# EAGLE board servo-ctrl (EAGLE 9.3.0), part 1 of 2
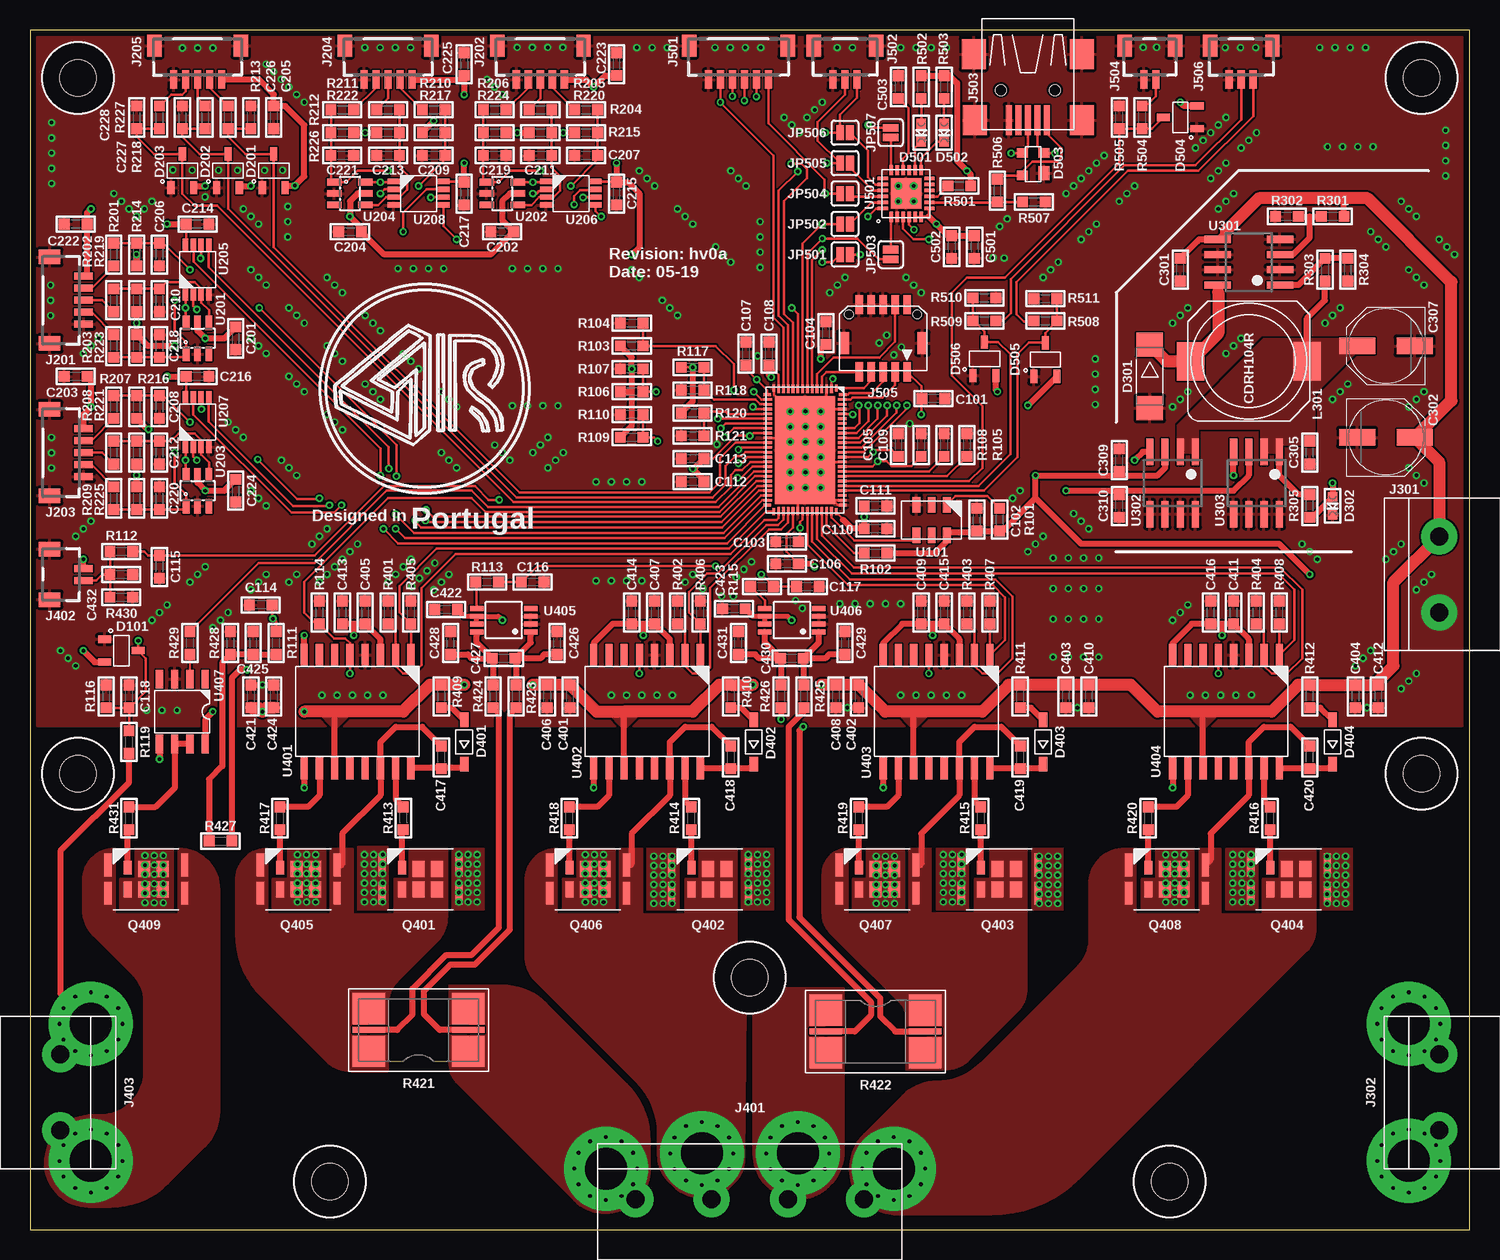
[diagram p5: board, top side]
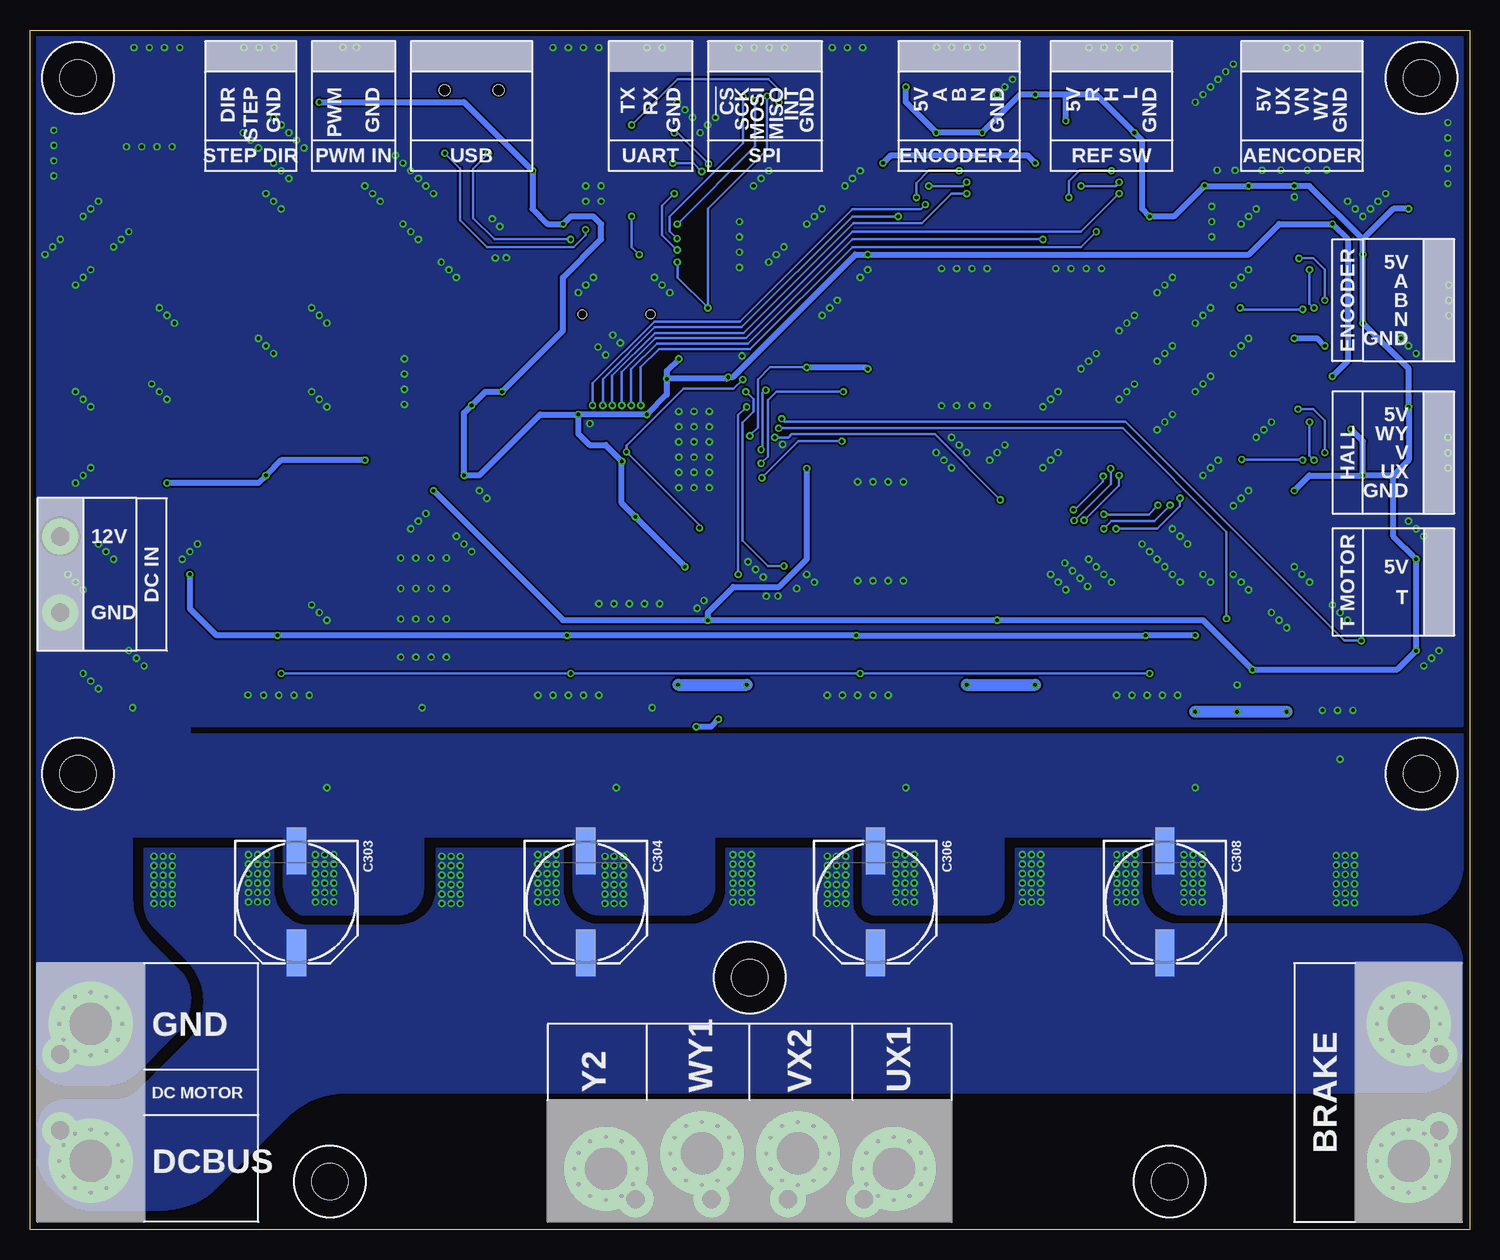
[diagram p6: board, bottom side, seen from below]

Size 120 x 100 mm. Coordinates in mm from the lower left corner, seen from the top.
Outline: 0,0 120,0 120,100 0,100 0,0
Copper layers (1*16): Top 0.035mm / dielectric 1.5mm / Bottom 0.035mm
Design rules "mask_vias *": minimum track width 5mil, minimum drill 0.3mm, track to track 6mil, track to pad 6mil, pad to pad 6mil, via to via 6mil, smd to smd 6mil, copper to edge 0.2mm, drill to drill 5mil, minimum pad ring 3mil, minimum via ring 3mil, stop-mask expansion 4mil, vias tented up to drill 0.8mm, thermal gap 10mil
Holes 3 mm at 4,38 25,4 95,4 116,38 4,96 116,96 60,21
tRestrict: area 57,18 to 63,24; area 1,93 to 7,99; area 113,93 to 119,99
bRestrict: area 113,35 to 119,41; area 57,18 to 63,24; area 1,35 to 7,41; area 1,93 to 7,99; area 113,93 to 119,99

## Footprints (pad centres in the part's own frame; a part is rotated, then mirrored left to right if it is on the bottom)
0603_WAVE = smd 0.9 x 0.9: P$1 -0.95,0; P$2 0.95,0
PANASONIC_D = smd 3 x 1.4: + 2.4,0; - -2.4,0
PANASONIC_G = smd 3.9 x 1.6: + 4.25,0; - -4.25,0
SOT-23-3 = smd 0.6 x 1.1: P$1 -0.95,-1.4; P$2 0.95,-1.4; P$3 0,1.4
DO214AA = smd 2 x 2.2: A 2.65,0; C -2.65,0
CHIPLED_0603 = smd 0.8 x 0.8: A 0,-0.75; C 0,0.75
SOD-123 = smd 1.2 x 0.7: A 1.85,0; C -1.85,0
SOT143 = smd 1.2 x 0.9: 1 -0.711,-0.889 | smd 0.8 x 0.9: 2 0.989,-0.889; 3 0.989,0.911; 4 -0.911,0.911
SM05B-SSR-H-TB = smd 0.6 x 1.55: 1 -2,1.925; 2 -1,1.925; 3 0,1.925; 4 1,1.925; 5 2,1.925 | smd 1.2 x 1.8: FIT@1 -3.6,-0.9; FIT@2 3.6,-0.9
2P-6.35P = drill 1.5 pad 3: 1 -3.175,0; 2 3.175,0
4P-6.35P = drill 1.5 pad 3: 1 -9.525,0; 2 -3.175,0; 3 3.175,0; 4 9.525,0
SM02B-SSR-H-TB = smd 0.6 x 1.55: 1 -0.5,1.925; 2 0.5,1.925 | smd 1.2 x 1.8: FIT@1 -2.1,-0.9; FIT@2 2.1,-0.9
SM06B-SSR-H-TB = smd 0.6 x 1.55: 1 -2.5,1.925; 2 -1.5,1.925; 3 -0.5,1.925; 4 0.5,1.925; 5 1.5,1.925; 6 2.5,1.925 | smd 1.2 x 1.8: FIT@1 -4.1,-0.9; FIT@2 4.1,-0.9
SM03B-SSR-H-TB = smd 0.6 x 1.55: 1 -1,1.925; 2 0,1.925; 3 1,1.925 | smd 1.2 x 1.8: FIT@1 -2.6,-0.9; FIT@2 2.6,-0.9
USB-M-S1 = smd 2.5 x 0.5: D+ 2.75,0; D- 2.75,0.8; GND 2.75,-1.6; ID 2.75,-0.8; VBUS 2.75,1.6 | smd 2.5 x 2: GND@1 -2.75,-4.5; GND@2 -2.75,4.5; GND@3 2.75,-4.4; GND@4 2.75,4.5 | hole 0.9: 0.25,2.25; 0.25,-2.25
F20F-10DP-1V = smd 0.6 x 1.6: 1 -2,2.8; 2 -2,-2.8; 3 -1,2.8; 4 -1,-2.8; 5 0,2.8; 6 0,-2.8; 7 1,2.8; 8 1,-2.8; 9 2,2.8; 10 2,-2.8 | smd 0.85 x 1.8: TAB1 -3.275,0.4; TAB2 3.275,0.4 | hole 0.7: -2.85,-2.005; 2.85,-2.005
SMT-JUMPER_2_NC_PASTE_SILK = smd 0.635 x 1.27: 1 -0.406,0; 2 0.406,0
SMT-JUMPER_2_NO_SILK = smd 0.635 x 1.27: 1 -0.406,0; 2 0.406,0
CDRH104R = smd 3.2 x 2.3: 1 0,-4.85; 2 0,4.85
TH-HP = drill 0.3: H1 2.625,0; H2 2.273,1.312; H3 1.312,2.273; H4 0,2.625; H5 -1.312,2.273; H6 -2.273,1.312; H7 -2.625,0; H8 -2.273,-1.312; H9 -1.312,-2.273; H10 0,-2.625; H11 1.312,-2.273; H12 2.273,-1.312 | drill 3.5 pad 7: PAD 0,0
DIRECTFET-ME = smd 0.6 x 1.9: D1 -3.025,1.175; D2 -3.025,-1.175; D3 3.375,-1.175; D4 3.375,1.175 | smd 0.65 x 1.15: G -1.375,0.95 | smd 0.65 x 1.35: S1 -1.375,-0.85 | smd 1 x 1.35: S2 0,-0.85; S3 1.55,-0.85; S4 1.55,0.85; S5 0,0.85
3920 = smd 2.7 x 2.592: 1 -4.15,1.778; 2 -4.15,-1.778; 3 4.15,-1.778; 4 4.15,1.778 | smd 2.7 x 0.508: SENSE+ -4.15,0; SENSE- 4.15,0
CDFN_5X3.2 = smd 1.3 x 0.64: 1 -1.277,1.27; 2 -1.277,0; 3 -1.277,-1.27; 4 1.277,-1.27; 5 1.277,0; 6 1.277,1.27
QFN76 = smd 0.6 x 0.225: 1 -5.15,2.6; 14 -5.15,-2.6; 39 5.15,-2.6; 52 5.15,2.6 | smd 0.7 x 0.225: 2 -5.1,2.2; 3 -5.1,1.8; 4 -5.1,1.4; 5 -5.1,1; 6 -5.1,0.6; 7 -5.1,0.2; 8 -5.1,-0.2; 9 -5.1,-0.6; 10 -5.1,-1; 11 -5.1,-1.4; 12 -5.1,-1.8; 13 -5.1,-2.2; 40 5.1,-2.2; 41 5.1,-1.8; 42 5.1,-1.4; 43 5.1,-1; 44 5.1,-0.6; 45 5.1,-0.2; 46 5.1,0.2; 47 5.1,0.6; 48 5.1,1; 49 5.1,1.4; 50 5.1,1.8; 51 5.1,2.2 | smd 0.225 x 0.6: 15 -4.6,-3.15; 38 4.6,-3.15; 53 4.6,3.15; 76 -4.6,3.15 | smd 0.225 x 0.7: 16 -4.2,-3.1; 17 -3.8,-3.1; 18 -3.4,-3.1; 19 -3,-3.1; 20 -2.6,-3.1; 21 -2.2,-3.1; 22 -1.8,-3.1; 23 -1.4,-3.1; 24 -1,-3.1; 25 -0.6,-3.1; 26 -0.2,-3.1; 27 0.2,-3.1; 28 0.6,-3.1; 29 1,-3.1; 30 1.4,-3.1; 31 1.8,-3.1; 32 2.2,-3.1; 33 2.6,-3.1; 34 3,-3.1; 35 3.4,-3.1; 36 3.8,-3.1; 37 4.2,-3.1; 54 4.2,3.1; 55 3.8,3.1; 56 3.4,3.1; 57 3,3.1; 58 2.6,3.1; 59 2.2,3.1; 60 1.8,3.1; 61 1.4,3.1; 62 1,3.1; 63 0.6,3.1; 64 0.2,3.1; 65 -0.2,3.1; 66 -0.6,3.1; 67 -1,3.1; 68 -1.4,3.1; 69 -1.8,3.1; 70 -2.2,3.1; 71 -2.6,3.1; 72 -3,3.1; 73 -3.4,3.1; 74 -3.8,3.1; 75 -4.2,3.1 | smd 9 x 5: PAD 0,0
SOT23-6 = smd 0.55 x 1.2: 1 -0.95,-1.3; 2 0,-1.3; 3 0.95,-1.3; 4 0.95,1.3; 5 0,1.3; 6 -0.95,1.3
TSSOP-8 = smd 0.45 x 1: 1 -1.005,-2.081; 2 -0.355,-2.081; 3 0.295,-2.081; 4 0.945,-2.081; 5 0.945,2.081; 6 0.295,2.081; 7 -0.355,2.081; 8 -1.005,2.081
SOIC8 = smd 0.6 x 2.2: 1 -1.905,-2.6; 2 -0.635,-2.6; 3 0.635,-2.6; 4 1.905,-2.6; 5 1.905,2.6; 6 0.635,2.6; 7 -0.635,2.6; 8 -1.905,2.6
SOIC-16-WB = smd 0.6 x 1.9: 1 -4.445,-4.7; 2 -3.175,-4.7; 3 -1.905,-4.7; 4 -0.635,-4.7; 5 0.635,-4.7; 6 1.905,-4.7; 7 3.175,-4.7; 8 4.445,-4.7; 9 4.445,4.7; 10 3.175,4.7; 11 1.905,4.7; 12 0.635,4.7; 13 -0.635,4.7; 14 -1.905,4.7; 15 -3.175,4.7; 16 -4.445,4.7
MSOP-8 = smd 0.4 x 1.1: 1 -0.975,-2.25; 2 -0.325,-2.25; 3 0.325,-2.25; 4 0.975,-2.25; 5 0.975,2.25; 6 0.325,2.25; 7 -0.325,2.25; 8 -0.975,2.25
SOIC_8 = smd 0.6 x 1.55: 1 -1.905,-2.7; 2 -0.635,-2.7; 3 0.635,-2.7; 4 1.905,-2.7; 5 1.905,2.7; 6 0.635,2.7; 7 -0.635,2.7; 8 -1.905,2.7
QFN24 = smd 0.3 x 0.85: 1 -1.25,-1.95; 2 -0.75,-1.95; 3 -0.25,-1.95; 4 0.25,-1.95; 5 0.75,-1.95; 6 1.25,-1.95; 13 1.25,1.95; 14 0.75,1.95; 15 0.25,1.95; 16 -0.25,1.95; 17 -0.75,1.95; 18 -1.25,1.95 | smd 0.85 x 0.3: 7 1.95,-1.25; 8 1.95,-0.75; 9 1.95,-0.25; 10 1.95,0.25; 11 1.95,0.75; 12 1.95,1.25; 19 -1.95,1.25; 20 -1.95,0.75; 21 -1.95,0.25; 22 -1.95,-0.25; 23 -1.95,-0.75; 24 -1.95,-1.25 | smd 2.55 x 2.55: PAD 0,0

## Placement (x,y rotation side)
C101  100n  [0603_WAVE]  75.31,69.28 0 top
C102  100n  [0603_WAVE]  78.93,59.18 90 top
C103  100n  [0603_WAVE]  63.12,57.34 180 top
C104  100n  [0603_WAVE]  66.36,74.74 90 top
C105  100n  [0603_WAVE]  72.39,65.41 90 top
C106  100n  [0603_WAVE]  63.12,55.5 180 top
C107  100n  [0603_WAVE]  59.69,73.03 90 top
C108  100n  [0603_WAVE]  61.59,73.03 90 top
C109  100n  [0603_WAVE]  74.3,65.41 90 top
C110  100n  [0603_WAVE]  70.48,58.42 0 top
C111  4u7  [0603_WAVE]  70.48,60.33 0 top
C112  100n  [0603_WAVE]  55.24,62.36 180 top
C113  4u7  [0603_WAVE]  55.24,64.26 180 top
C114  100p  [0603_WAVE]  19.24,52.07 180 top
C115  100p  [0603_WAVE]  10.79,55.24 270 top
C116  100p  [0603_WAVE]  41.91,53.98 0 top
C117  100p  [0603_WAVE]  64.83,53.59 0 top
C118  100p  [0603_WAVE]  8.26,44.45 90 top
C201  4u7  [0603_WAVE]  17.14,74.3 270 top
C202  4u7  [0603_WAVE]  39.37,83.19 180 top
C203  4u7  [0603_WAVE]  3.81,71.12 180 top
C204  4u7  [0603_WAVE]  26.67,83.19 180 top
C205  4u7  [0603_WAVE]  20.32,92.71 270 top
C206  100p  [0603_WAVE]  10.79,81.28 270 top
C207  100p  [0603_WAVE]  46.35,89.53 180 top
C208  100p  [0603_WAVE]  10.79,68.58 270 top
C209  100p  [0603_WAVE]  33.66,89.53 180 top
C210  100p  [0603_WAVE]  10.79,77.47 270 top
C211  100p  [0603_WAVE]  42.55,89.53 180 top
C212  100p  [0603_WAVE]  10.79,64.77 270 top
C213  100p  [0603_WAVE]  29.84,89.53 180 top
C214  100n  [0603_WAVE]  13.97,83.82 0 top
C215  100n  [0603_WAVE]  48.9,86.36 270 top
C216  100n  [0603_WAVE]  13.97,71.12 0 top
C217  100n  [0603_WAVE]  36.2,86.36 270 top
C218  100p  [0603_WAVE]  10.79,73.66 90 top
C219  100p  [0603_WAVE]  38.73,89.53 0 top
C220  100p  [0603_WAVE]  10.79,60.96 90 top
C221  100p  [0603_WAVE]  26.04,89.53 0 top
C222  100n  [0603_WAVE]  3.81,83.82 180 top
C223  100n  [0603_WAVE]  48.9,97.16 90 top
C224  100n  [0603_WAVE]  17.14,61.59 270 top
C225  100n  [0603_WAVE]  36.2,97.16 90 top
C226  100p  [0603_WAVE]  18.41,92.71 90 top
C227  100p  [0603_WAVE]  12.7,92.71 90 top
C228  100p  [0603_WAVE]  8.89,92.71 90 top
C301  4u7  [0603_WAVE]  95.89,80.01 270 top
C302  100u  [PANASONIC_D]  113.03,66.04 0 top
C303  330u  [PANASONIC_G]  97.79,27.3 270 bottom
C304  330u  [PANASONIC_G]  73.66,27.3 270 bottom
C305  4u7  [0603_WAVE]  106.68,64.77 270 top
C306  330u  [PANASONIC_G]  49.53,27.3 270 bottom
C307  100u  [PANASONIC_D]  113.03,73.66 180 top
C308  330u  [PANASONIC_G]  25.4,27.3 270 bottom
C309  4u7  [0603_WAVE]  90.81,64.14 90 top
C310  4u7  [0603_WAVE]  90.81,60.33 270 top
C401  100n  [0603_WAVE]  45.02,44.45 270 top
C402  100n 25v  [0603_WAVE]  69.09,44.45 270 top
C403  100n 25v  [0603_WAVE]  86.36,44.45 270 top
C404  100n 25v  [0603_WAVE]  110.49,44.45 270 top
C405  4u7  [0603_WAVE]  27.94,51.44 90 top
C406  10u 25v  [0603_WAVE]  43.12,44.45 270 top
C407  4u7  [0603_WAVE]  52.07,51.44 90 top
C408  10u 25v  [0603_WAVE]  67.18,44.45 270 top
C409  4u7  [0603_WAVE]  74.3,51.44 90 top
C410  10u 25v  [0603_WAVE]  88.27,44.45 270 top
C411  4u7  [0603_WAVE]  100.33,51.44 90 top
C412  10u 25v  [0603_WAVE]  112.39,44.45 270 top
C413  100n  [0603_WAVE]  26.04,51.44 90 top
C414  100n  [0603_WAVE]  50.16,51.44 90 top
C415  100n  [0603_WAVE]  76.2,51.44 90 top
C416  100n  [0603_WAVE]  98.42,51.44 90 top
C417  220n 25v  [0603_WAVE]  34.29,39.37 90 top
C418  220n 25v  [0603_WAVE]  58.42,39.37 90 top
C419  220n 25v  [0603_WAVE]  82.55,39.37 90 top
C420  220n 25v  [0603_WAVE]  106.68,39.37 90 top
C421  100n 25v  [0603_WAVE]  18.41,44.45 90 top
C422  100n  [0603_WAVE]  34.67,51.69 180 top
C423  100n  [0603_WAVE]  58.67,51.75 180 top
C424  10u 25v  [0603_WAVE]  20.32,44.45 90 top
C425  100p  [0603_WAVE]  18.61,48.9 90 top
C426  100n  [0603_WAVE]  43.94,48.9 270 top
C427  100n  [0603_WAVE]  39.5,47.62 180 top
C428  100n  [0603_WAVE]  35.05,48.9 90 top
C429  100n  [0603_WAVE]  67.94,48.9 270 top
C430  100n  [0603_WAVE]  63.5,47.62 180 top
C431  100n  [0603_WAVE]  59.05,48.9 90 top
C432  100p  [0603_WAVE]  7.62,54.61 0 top
C501  100n  [0603_WAVE]  78.74,81.92 270 top
C502  4u7  [0603_WAVE]  76.83,81.92 270 top
C503  4u7  [0603_WAVE]  72.39,95.25 90 top
D101  BAT54S  [SOT-23-3]  7.62,48.26 270 top
D201  BAT54S  [SOT-23-3]  20.32,88.27 0 top
D202  BAT54S  [SOT-23-3]  16.51,88.27 0 top
D203  BAT54S  [SOT-23-3]  12.7,88.27 0 top
D301  SK54L  [DO214AA]  93.34,71.12 270 top
D302  LED0603  [CHIPLED_0603]  108.58,60.33 180 top
D401  DSK24  [SOD-123]  36.2,40.64 90 top
D402  DSK24  [SOD-123]  60.33,40.64 90 top
D403  DSK24  [SOD-123]  84.45,40.64 90 top
D404  DSK24  [SOD-123]  108.58,40.64 90 top
D501  LED0603  [CHIPLED_0603]  74.3,91.44 180 top
D502  LED0603  [CHIPLED_0603]  76.2,91.44 180 top
D503  SP0503BAHT  [SOT143]  83.63,88.77 90 top
D504  BAT54S  [SOT-23-3]  95.89,92.71 90 top
D505  BAT54S  [SOT-23-3]  84.65,72.52 0 top
D506  BAT54S  [SOT-23-3]  79.57,72.58 0 top
J201  SH-5  [SM05B-SSR-H-TB]  2.54,77.47 270 top
J202  SH-5  [SM05B-SSR-H-TB]  42.55,97.79 180 top
J203  SH-5  [SM05B-SSR-H-TB]  2.54,64.77 270 top
J204  SH-5  [SM05B-SSR-H-TB]  29.84,97.79 180 top
J205  SH-5  [SM05B-SSR-H-TB]  13.97,97.79 180 top
J301  2P-6.35P  [2P-6.35P]  117.47,54.61 90 top
J302  2P-6.35P  [2P-6.35P]  117.47,11.43 90 top
J401  4P-6.35P  [4P-6.35P]  60,2.54 0 top
J402  SH-2  [SM02B-SSR-H-TB]  2.54,54.61 270 top
J403  2P-6.35P  [2P-6.35P]  2.54,11.43 270 top
J501  SH-6  [SM06B-SSR-H-TB]  59.05,97.79 180 top
J502  SH-3  [SM03B-SSR-H-TB]  67.94,97.79 180 top
J503  USB-SHIELD  [USB-M-S1]  83.19,95.25 270 top
J504  SH-2  [SM02B-SSR-H-TB]  93.34,97.79 180 top
J505  F20F-10DP-1V  [F20F-10DP-1V]  71.12,74.3 180 top
J506  SH-3  [SM03B-SSR-H-TB]  100.97,97.79 180 top
JP501  JUMPER-SMT_2_NC_PASTE_SILK  [SMT-JUMPER_2_NC_PASTE_SILK]  67.94,81.28 180 top
JP502  JUMPER-SMT_2_NC_PASTE_SILK  [SMT-JUMPER_2_NC_PASTE_SILK]  67.94,83.82 180 top
JP503  JUMPER-SMT_2_NC_PASTE_SILK  [SMT-JUMPER_2_NC_PASTE_SILK]  71.75,81.28 270 top
JP504  JUMPER-SMT_2_NC_PASTE_SILK  [SMT-JUMPER_2_NC_PASTE_SILK]  67.94,86.36 180 top
JP505  JUMPER-SMT_2_NO_SILK  [SMT-JUMPER_2_NO_SILK]  67.94,88.9 180 top
JP506  JUMPER-SMT_2_NO_SILK  [SMT-JUMPER_2_NO_SILK]  67.94,91.44 180 top
JP507  JUMPER-SMT_2_NC_PASTE_SILK  [SMT-JUMPER_2_NC_PASTE_SILK]  71.75,91.44 90 top
L301  68uH  [CDRH104R]  101.6,72.39 270 top
P301  POWPAD  [TH-HP]  114.94,5.71 0 top
P302  POWPAD  [TH-HP]  114.94,17.14 0 top
P401  POWPAD  [TH-HP]  56,6.35 90 top
P402  POWPAD  [TH-HP]  72,5.08 90 top
P403  POWPAD  [TH-HP]  48,5.08 90 top
P404  POWPAD  [TH-HP]  64,6.35 90 top
P405  POWPAD  [TH-HP]  5.08,17.14 0 top
P406  POWPAD  [TH-HP]  5.08,5.71 0 top
Q401  IRF7580  [DIRECTFET-ME]  32.38,29.21 0 top
Q402  IRF7580  [DIRECTFET-ME]  56.52,29.21 0 top
Q403  IRF7580  [DIRECTFET-ME]  80.64,29.21 0 top
Q404  IRF7580  [DIRECTFET-ME]  104.78,29.21 0 top
Q405  IRF7580  [DIRECTFET-ME]  22.23,29.21 0 top
Q406  IRF7580  [DIRECTFET-ME]  46.35,29.21 0 top
Q407  IRF7580  [DIRECTFET-ME]  70.48,29.21 0 top
Q408  IRF7580  [DIRECTFET-ME]  94.61,29.21 0 top
Q409  IRF7580  [DIRECTFET-ME]  9.53,29.21 0 top
R101  10k  [0603_WAVE]  80.83,59.18 270 top
R102  10k  [0603_WAVE]  70.48,56.39 180 top
R103  10k  [0603_WAVE]  50.16,73.66 180 top
R104  10k  [0603_WAVE]  50.16,75.56 0 top
R105  10k  [0603_WAVE]  78.11,65.41 270 top
R106  10k  [0603_WAVE]  50.16,69.85 180 top
R107  10k  [0603_WAVE]  50.16,71.75 0 top
R108  10k  [0603_WAVE]  76.2,65.41 270 top
R109  10k  [0603_WAVE]  50.16,66.04 180 top
R110  10k  [0603_WAVE]  50.16,67.94 0 top
R111  100  [0603_WAVE]  20.51,48.9 270 top
R112  100  [0603_WAVE]  7.62,56.52 0 top
R113  100  [0603_WAVE]  38.1,53.98 180 top
R114  10k  [0603_WAVE]  24.13,51.44 90 top
R115  100  [0603_WAVE]  61.02,53.59 180 top
R116  10k  [0603_WAVE]  6.35,44.45 270 top
R117  10k  [0603_WAVE]  55.24,71.88 180 top
R118  10k  [0603_WAVE]  55.24,69.98 0 top
R119  140k  [0603_WAVE]  8.26,40.64 270 top
R120  10k  [0603_WAVE]  55.24,68.07 180 top
R121  10k  [0603_WAVE]  55.24,66.17 0 top
R201  100  [0603_WAVE]  6.99,81.28 90 top
R202  100  [0603_WAVE]  6.99,77.47 90 top
R203  100  [0603_WAVE]  6.99,73.66 270 top
R204  100  [0603_WAVE]  46.35,93.34 0 top
R205  100  [0603_WAVE]  42.55,93.34 0 top
R206  100  [0603_WAVE]  38.73,93.34 180 top
R207  100  [0603_WAVE]  6.99,68.58 90 top
R208  100  [0603_WAVE]  6.99,64.77 90 top
R209  100  [0603_WAVE]  6.99,60.96 270 top
R210  100  [0603_WAVE]  33.66,93.34 0 top
R211  100  [0603_WAVE]  29.84,93.34 0 top
R212  100  [0603_WAVE]  26.04,93.34 180 top
R213  100  [0603_WAVE]  16.51,92.71 270 top
R214  100k  [0603_WAVE]  8.89,81.28 90 top
R215  100k  [0603_WAVE]  46.35,91.44 0 top
R216  100k  [0603_WAVE]  8.89,68.58 90 top
R217  100k  [0603_WAVE]  33.66,91.44 0 top
R218  100  [0603_WAVE]  14.61,92.71 270 top
R219  100k  [0603_WAVE]  8.89,77.47 90 top
R220  100k  [0603_WAVE]  42.55,91.44 0 top
R221  100k  [0603_WAVE]  8.89,64.77 90 top
R222  100k  [0603_WAVE]  29.84,91.44 0 top
R223  100k  [0603_WAVE]  8.89,73.66 270 top
R224  100k  [0603_WAVE]  38.73,91.44 180 top
R225  100k  [0603_WAVE]  8.89,60.96 270 top
R226  100k  [0603_WAVE]  26.04,91.44 180 top
R227  100  [0603_WAVE]  10.79,92.71 270 top
R301  10M  [0603_WAVE]  108.58,84.45 0 top
R302  10k  [0603_WAVE]  104.78,84.45 0 top
R303  4.2k  [0603_WAVE]  107.95,80.01 270 top
R304  1.2k  [0603_WAVE]  109.86,80.01 90 top
R305  2k  [0603_WAVE]  106.68,60.33 90 top
R401  10k  [0603_WAVE]  29.84,51.44 270 top
R402  10k  [0603_WAVE]  53.98,51.44 270 top
R403  10k  [0603_WAVE]  78.11,51.44 270 top
R404  10k  [0603_WAVE]  102.23,51.44 270 top
R405  10k  [0603_WAVE]  31.75,51.44 270 top
R406  10k  [0603_WAVE]  55.88,51.44 270 top
R407  10k  [0603_WAVE]  80.01,51.44 270 top
R408  10k  [0603_WAVE]  104.14,51.44 270 top
R409  2.2  [0603_WAVE]  34.29,44.45 270 top
R410  2.2  [0603_WAVE]  58.42,44.45 270 top
R411  2.2  [0603_WAVE]  82.55,44.45 270 top
R412  2.2  [0603_WAVE]  106.68,44.45 270 top
R413  2.2  [0603_WAVE]  31.11,34.29 270 top
R414  2.2  [0603_WAVE]  55.12,34.29 270 top
R415  2.2  [0603_WAVE]  79.25,34.29 270 top
R416  2.2  [0603_WAVE]  103.38,34.29 270 top
R417  2.2  [0603_WAVE]  20.83,34.29 270 top
R418  2.2  [0603_WAVE]  44.96,34.29 270 top
R419  2.2  [0603_WAVE]  69.09,34.29 270 top
R420  2.2  [0603_WAVE]  93.22,34.29 270 top
R421  700u  [3920]  32.38,16.64 0 top
R422  700u  [3920]  70.48,16.51 180 top
R423  100  [0603_WAVE]  40.51,44.45 90 top
R424  100  [0603_WAVE]  38.61,44.45 90 top
R425  100  [0603_WAVE]  64.52,44.45 90 top
R426  100  [0603_WAVE]  62.61,44.45 90 top
R427  100k  [0603_WAVE]  15.88,32.38 0 top
R428  1k2  [0603_WAVE]  16.7,48.9 270 top
R429  220  [0603_WAVE]  13.34,48.9 90 top
R430  1k2  [0603_WAVE]  7.62,52.7 180 top
R431  2.2  [0603_WAVE]  8.26,34.29 270 top
R501  10k  [0603_WAVE]  77.47,87 180 top
R502  220  [0603_WAVE]  74.3,95.25 90 top
R503  220  [0603_WAVE]  76.2,95.25 90 top
R504  100  [0603_WAVE]  92.71,92.71 270 top
R505  10k  [0603_WAVE]  90.81,92.71 270 top
R506  5k  [0603_WAVE]  80.64,86.61 270 top
R507  10k  [0603_WAVE]  83.69,85.66 0 top
R508  100  [0603_WAVE]  84.65,75.76 0 top
R509  100  [0603_WAVE]  79.57,75.76 180 top
R510  10k  [0603_WAVE]  79.57,77.66 180 top
R511  10k  [0603_WAVE]  84.65,77.6 0 top
U101  DSC1101  [CDFN_5X3.2]  75.16,59.14 270 top
U102  TMC4671  [QFN76]  64.61,65 270 top
U201  SRV05-4  [SOT23-6]  13.97,74.3 0 top
U202  SRV05-4  [SOT23-6]  39.37,86.36 270 top
U203  SRV05-4  [SOT23-6]  13.97,61.59 0 top
U204  SRV05-4  [SOT23-6]  26.67,86.36 270 top
U205  74LVC3G17  [TSSOP-8]  13.97,80.01 0 top
U206  74LVC3G17  [TSSOP-8]  45.09,86.36 270 top
U207  74LVC3G17  [TSSOP-8]  13.97,67.31 0 top
U208  74LVC3G17  [TSSOP-8]  32.38,86.36 270 top
U301  MIC4682  [SOIC8]  101.6,80.64 90 top
U302  MIC39101  [SOIC8]  95.25,62.23 180 top
U303  MIC39101  [SOIC8]  102.23,62.23 180 top
U401  SI82397  [SOIC-16-WB]  27.3,43.18 180 top
U402  SI82397  [SOIC-16-WB]  51.44,43.18 180 top
U403  SI82397  [SOIC-16-WB]  75.56,43.18 180 top
U404  SI82397  [SOIC-16-WB]  99.69,43.18 180 top
U405  AD8418A  [MSOP-8]  39.5,50.8 90 top
U406  AD8418A  [MSOP-8]  63.5,50.8 90 top
U407  SI8261  [SOIC_8]  12.7,43.18 180 top
U501  CP2130/2102N  [QFN24]  73.03,86.36 0 top
U$1  [RAFAEL_SILVA_10MM_CIRCLE]  25.4,65.41 0 top